# Altium schematic sheet mboard_rf.SchDoc: =GlobalProjectName
size 410 x 297 mm; SheetNumber: Лист; SheetTotal: Листов; PageSetup: Record=PageOptions|CenterHorizontal=True|CenterVertical=True|PrintScale=1.00|XCorrection=1.00|YCorrection=1.00|PrintKind=1|BorderSize=5000000|LeftOffset=0|BottomOffset=0|Orientation=2|PaperLength=1000|PaperWidth=1000|Scale=100|PaperSource=15|PrintQuality=1200|MediaType=1|DitherType=10|PaperKind=A3|PrintScaleMode=1; Weight: -; ScaleFactor: -
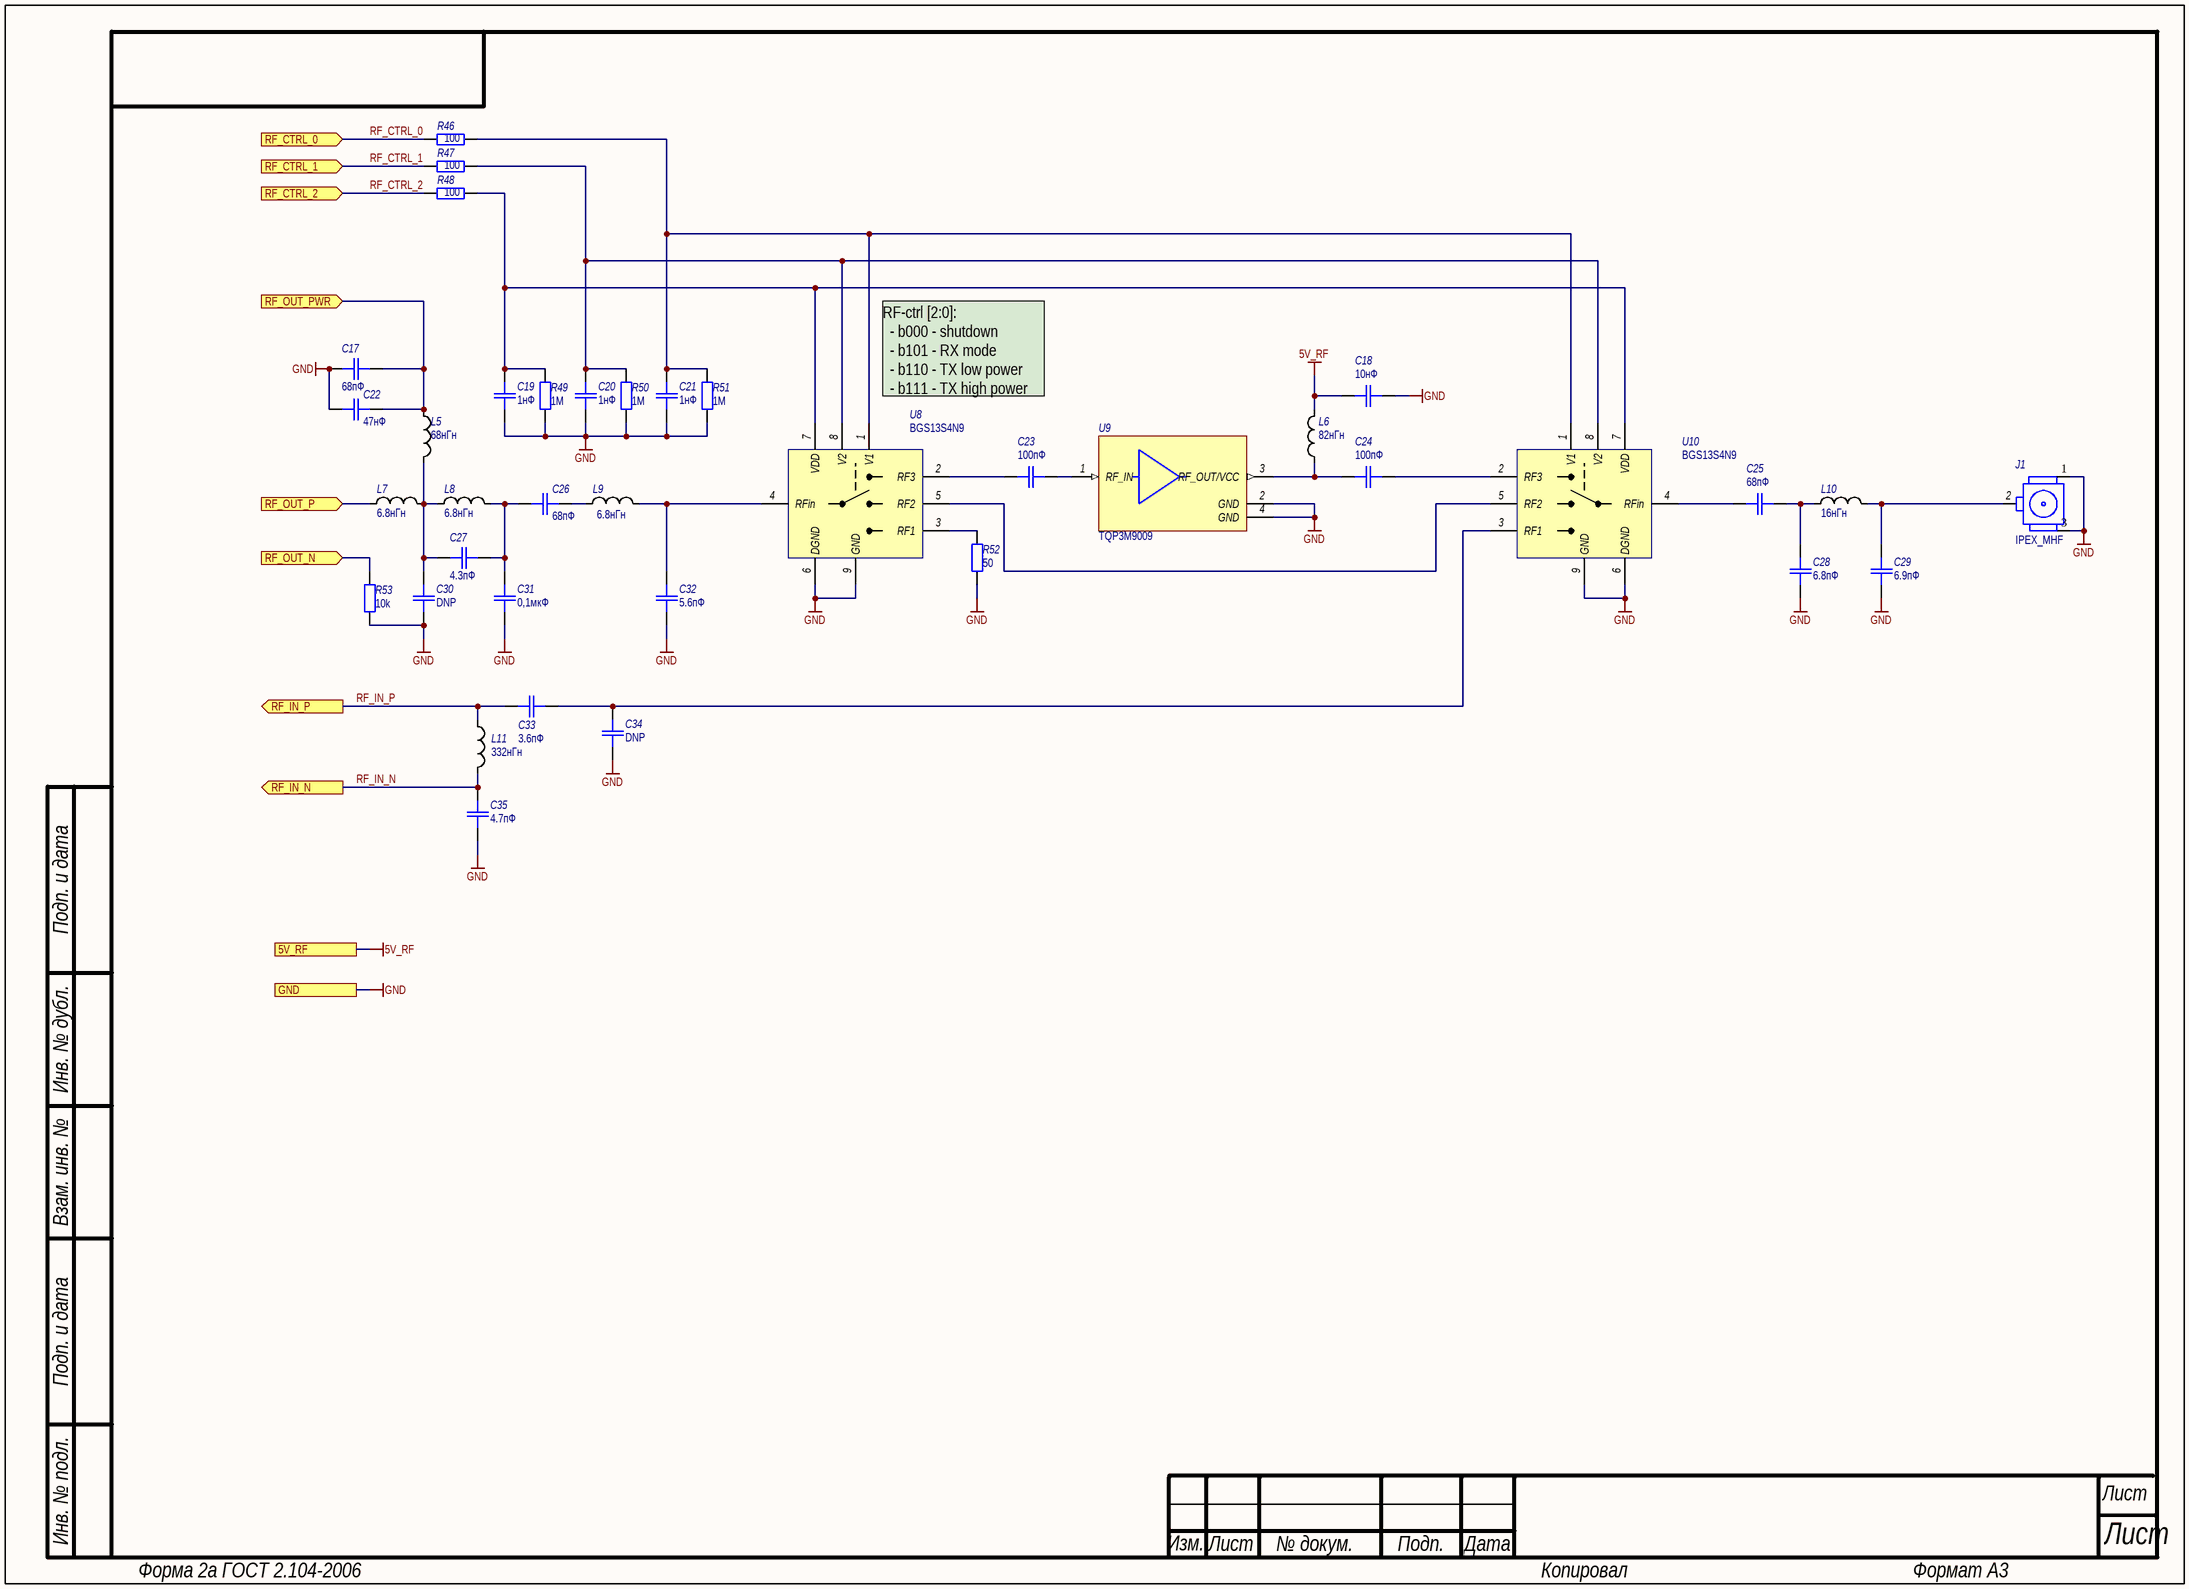
[diagram p0: mboard_rf.SchDoc]

## Parts
C17  value 68пФ  [SMD_C0603]  (hidden comment: K10-79)
C18  value 10нФ  [SMD_C0603]  (hidden comment: K10-79)
C19  value 1нФ  [SMD_C0402]  (hidden comment: K10-79)
C20  value 1нФ  [SMD_C0402]  (hidden comment: K10-79)
C21  value 1нФ  [SMD_C0402]  (hidden comment: K10-79)
C22  value 47нФ  [SMD_C0603]  (hidden comment: K10-79)
C23  value 100пФ  [SMD_C0402]  (hidden comment: K10-79)
C24  value 100пФ  [SMD_C0603]  (hidden comment: K10-79)
C25  value 68пФ  [SMD_C0603]  (hidden comment: K10-79)
C26  value 68пФ  [SMD_C0603]  (hidden comment: K10-79)
C27  value 4.3пФ  [SMD_C0402]  (hidden comment: K10-79)
C28  value 6.8пФ  [SMD_C0603]  (hidden comment: K10-79)
C29  value 6.9пФ  [SMD_C0603]  (hidden comment: K10-79)
C30  value DNP  [SMD_C0402]  (hidden comment: K10-79)
C31  value 0,1мкФ  [SMD_C0402]  (hidden comment: K10-79)
C32  value 5.6пФ  [SMD_C0603]  (hidden comment: K10-79)
C33  value 3.6пФ  [SMD_C0603]  (hidden comment: K10-79)
C34  value DNP  [SMD_C0603]  (hidden comment: K10-79)
C35  value 4.7пФ  [SMD_C0603]  (hidden comment: K10-79)
J1  IPEX_MHF  [IPEX_MHF]
L5  value 68нГн  [SMD_0805]  (hidden comment: Inductor)
L6  value 82нГн  [SMD_0805]  (hidden comment: Inductor)
L7  value 6.8нГн  [SMD_0805]  (hidden comment: Inductor)
L8  value 6.8нГн  [SMD_0805]  (hidden comment: Inductor)
L9  value 6.8нГн  [SMD_0805]  (hidden comment: Inductor)
L10  value 16нГн  [SMD_0805]  (hidden comment: Inductor)
L11  value 332нГн  [SMD_0805]  (hidden comment: Inductor)
R46  value 100  [SMD_0805]  (hidden comment: OSM R1-12)
R47  value 100  [SMD_0805]  (hidden comment: OSM R1-12)
R48  value 100  [SMD_0805]  (hidden comment: OSM R1-12)
R49  value 1M  [SMD_0805]  (hidden comment: OSM R1-12)
R50  value 1M  [SMD_0805]  (hidden comment: OSM R1-12)
R51  value 1M  [SMD_0805]  (hidden comment: OSM R1-12)
R52  value 50  [SMD_0805]  (hidden comment: OSM R1-12)
R53  value 10k  [SMD_0805]  (hidden comment: OSM R1-12)
U8  BGS13S4N9  [TSNP-9-3]
U9  High Linearity LNA Gain Block  [SOT89]  (value not drawn)
U10  BGS13S4N9  [TSNP-9-3]

## Ports
5V_RF, GND, RF_CTRL_0 (in), RF_CTRL_1 (in), RF_CTRL_2 (in), RF_IN_N (out), RF_IN_P (out), RF_OUT_N (in), RF_OUT_P (in), RF_OUT_PWR (in)

## Nets
5V_RF: C18.1 L6.2 ; port 5V_RF
GND: C17.2 C18.2 C19.1 C20.1 C21.1 C22.1 C28.1 C29.1 C30.2 C31.2 C32.2 C34.1 C35.2 J1.1 J1.3 R49.2 R50.2 R51.2 R52.2 R53.2 U8.6(DGND) U8.9(GND) U9.2(GND) U9.4(GND) U10.6(DGND) U10.9(GND) ; port GND
RF_CTRL_0: R46.1 ; port RF_CTRL_0
RF_CTRL_1: R47.1 ; port RF_CTRL_1
RF_CTRL_2: R48.1 ; port RF_CTRL_2
RF_IN_N: C35.1 L11.2 ; port RF_IN_N
RF_IN_P: C33.1 L11.1 ; port RF_IN_P
RF_OUT_N: R53.1 ; port RF_OUT_N
RF_OUT_P: L7.2 ; port RF_OUT_P
RF_OUT_PWR: C17.1 C22.2 L5.2 ; port RF_OUT_PWR
NetC19_2: C19.2 R48.2 R49.1 U8.7(VDD) U10.7(VDD)
NetC20_2: C20.2 R47.2 R50.1 U8.8(V2) U10.8(V2)
NetC21_2: C21.2 R46.2 R51.1 U8.1(V1) U10.1(V1)
NetC23_1: C23.1 U8.2(RF3)
NetC23_2: C23.2 U9.1(RF_IN)
NetC24_1: C24.1 L6.1 U9.3(RF_OUT/VCC)
NetC24_2: C24.2 U10.2(RF3)
NetC25_1: C25.1 U10.4(RFin)
NetC25_2: C25.2 C28.2 L10.1
NetC26_1: C26.1 C27.2 C31.1 L8.1
NetC26_2: C26.2 L9.1
NetC27_1: C27.1 C30.1 L5.1 L7.1 L8.2
NetC29_2: C29.2 J1.2 L10.2
NetC32_1: C32.1 L9.2 U8.4(RFin)
NetC33_2: C33.2 C34.2 U10.3(RF1)
NetR52_1: R52.1 U8.3(RF1)
NetU8_5: U8.5(RF2) U10.5(RF2)

## Notes on the sheet
- RF-ctrl [2:0]:
  - b000 - shutdown
  - b101 - RX mode
  - b110 - TX low power
  - b111 - TX high power
- Подп. и дата
- Инв. № дубл.
- Взам. инв. №
- Инв. № подл.
- Изм.
- Лист
- № докум.
- Подп.
- Дата
- Форма 2а ГОСТ 2.104-2006
- Копировал
- Формат А3

## Library data of the parts
C17-C35 = Capacitor: Назначение: SMD-конденсатор; Наименование: К10-79; Потребление, Вт: 0; Точность: %; Напряжение: В; Диэлектрик: *
J1 = IPEX_MHF: RF Connector, Onboard Receptacle, IPEX MHF, 3x3mm; Потребление, Вт: 0.0; ComponentLink2URL: https://static.chipdip.ru/lib/947/DOC011947657.pdf; ComponentLink2Description: Datasheet; Назначение: RF Connector, Onboard Receptacle, IPEX MHF, 3x3mm; Наименование: IPEX_MHF
L5-L11 = Inductor: Наименование: Индуктивность; Назначение: SMD-индуктивность; Потребление, Вт: 0,010
R46-R53 = Resistor: Наименование: ОСМ Р1-12; Назначение: SMD-резистор; Потребление, Вт: 0,001; Точность: %
U8 U10 = BGS13S4N9: Wideband RF SP3T Switch; Internal_Part_Number: MCD-02018; Part_Type: IC; Manufacturer: INFINEON; ECCN_US: EAR99; ECCN_EU: tbd; Provided_By: SUBCO; Потребление, Вт: 0.001; Status: Checked; Manufacturer_Part_Number: BGS13S4N9; Package: TSNP-9-3; ComponentLink1Description: Datasheet; ComponentLink1URL: http://tunmcdsvn.tun.st.com/Component_Datasheet_Library/Trunk/IC/Infineon_SP3T_BGS13S4N9/Infineon-BGS13S4N9-DS-v01_00-EN.pdf; Value: BGS13S4N9; Назначение: Wideband RF SP3T Switch; Наименование: BGS13S4N9
U9 = TQP3M9009: Потребление, Вт: 0.5; Назначение: High Linearity LNA Gain Block; ComponentLink1Description: DataSheet; ComponentLink1URL: https://ru.mouser.com/datasheet/2/412/TQP3M9009-189509.pdf; Название: TQP3M9009